# EAGLE design NSE2024 (EAGLE 9.6.2)
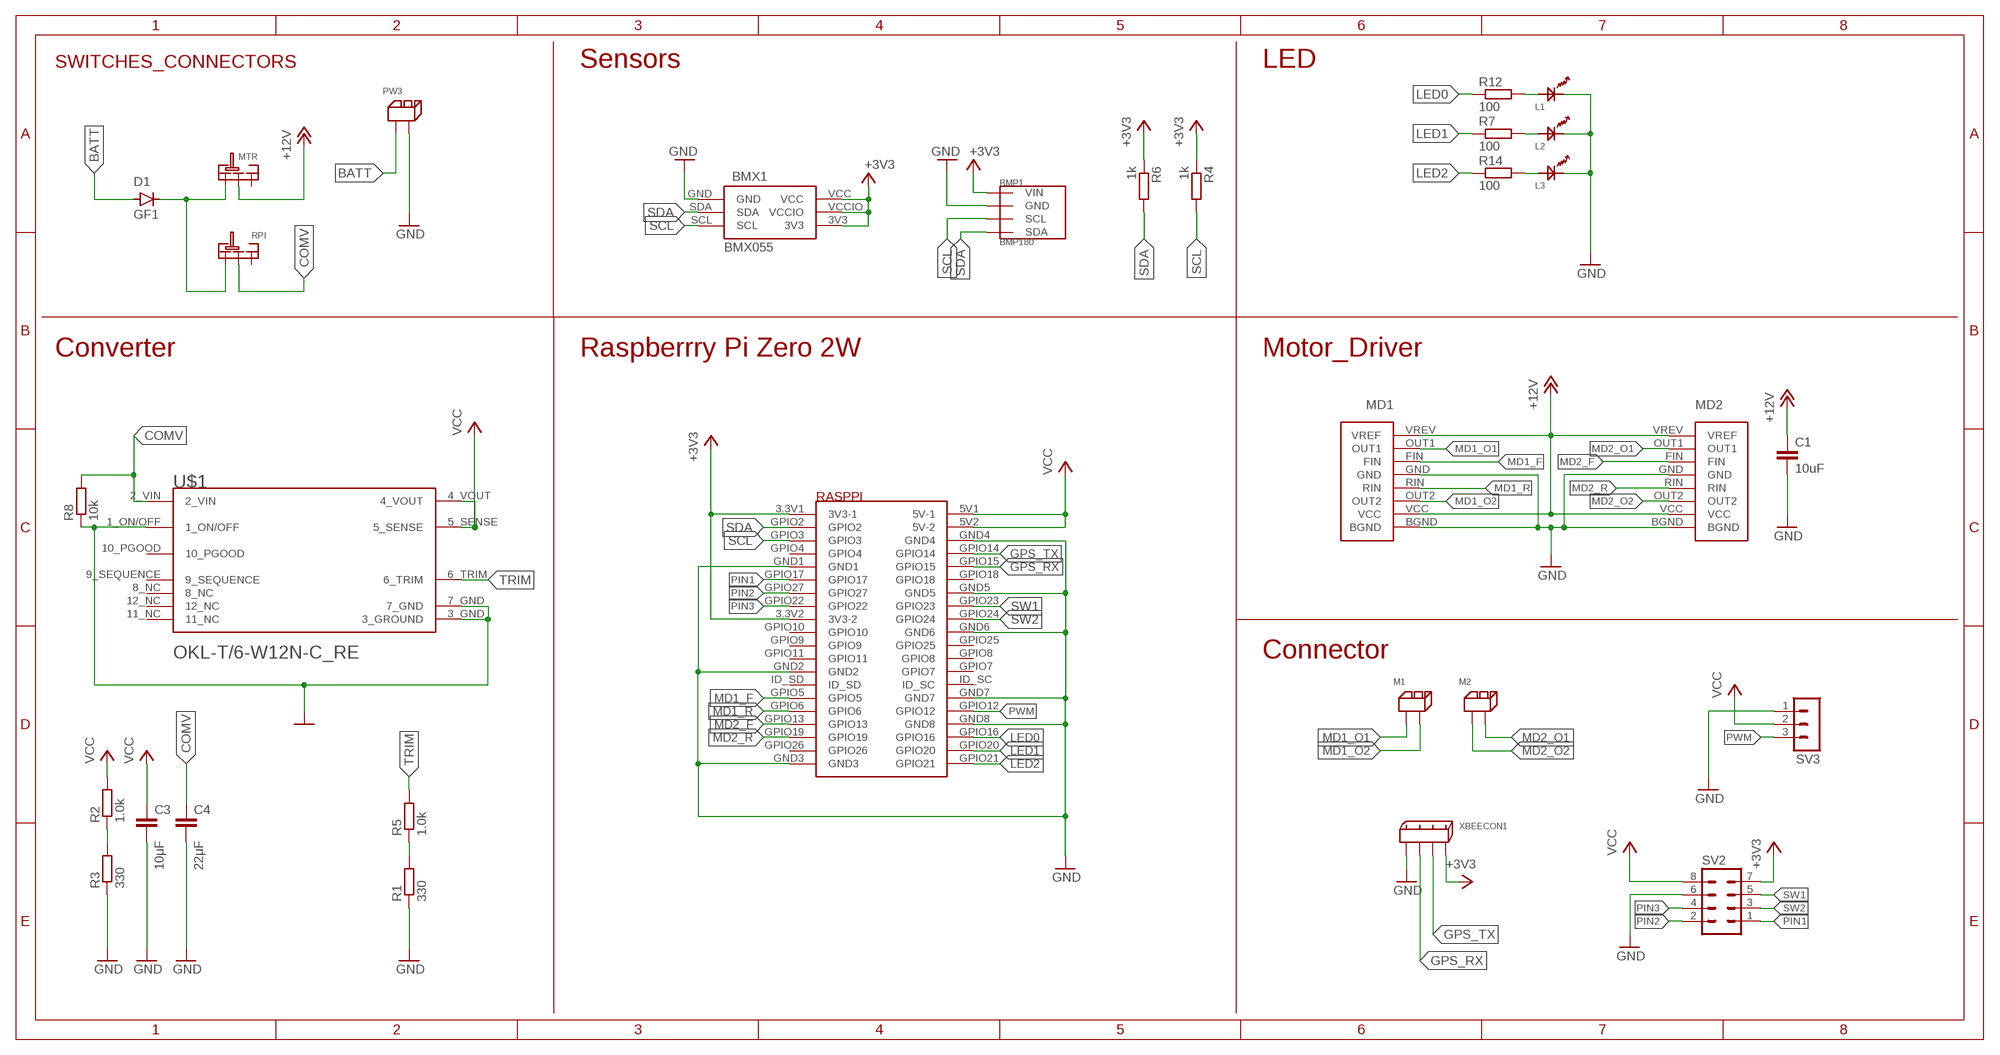
[diagram p0: schematic, sheet 1]

## Parts
BMP1  BMP180  [GY-68]
BMX1  BMX055  [BMX055]
C1  10uF  C-EUC0603  [C0603]
C3  10μF  C-EUC0603  [C0603]
C4  22μF  C-EUC0805  [C0805]
D1  GF1  [SMA-DO214AC]
L1  OSXX1608C1A  [OSXX1608C1A]
L2  OSXX1608C1A  [OSXX1608C1A]
L3  OSXX1608C1A  [OSXX1608C1A]
M1  2PIN  [2PIN]
M2  2PIN  [2PIN]
MD1  BD6222HFP-TR  [BD6222HFP-TR]
MD2  BD6222HFP-TR  [BD6222HFP-TR]
MTR  SRIDE_SWITCH  [SRIDE_SWITCH]
PW3  2PIN  [2PIN]
R1  330  R-EU_R0603  [R0603]
R2  1.0k  R-EU_R0603  [R0603]
R3  330  R-EU_R0603  [R0603]
R4  1k  R-EU_R0603  [R0603]
R5  1.0k  R-EU_R0603  [R0603]
R6  1k  R-EU_R0603  [R0603]
R7  100  R-EU_R0603  [R0603]
R8  10k  R-EU_R0603  [R0603]
R12  100  R-EU_R0603  [R0603]
R14  100  R-EU_R0603  [R0603]
RASPPI  RASPBERYPIZEROW  [RASPBERYPIZEROW]
RPI  SRIDE_SWITCH  [SRIDE_SWITCH]
SV2  MA04-2  [MA04-2]
SV3  MA03-1  [MA03-1]
U$1  OKL-T/6-W12N-C_RE  [MURATA_IKL-T-6-W12N-C_0_RECOMENDED]
XBEECON1  2.5_MINI-SPOX_4PIN  [2.5_MINI-SPOX_4PIN]

## Nets
+3V3: BMP1.P1(VIN) BMX1.3V3 BMX1.VCC BMX1.VCCIO R4.1 R6.1 RASPPI.3.3V1(3V3-1) RASPPI.3.3V2(3V3-2) SV2.7 XBEECON1.P$4
+5V: C3.1 U$1.4_VOUT U$1.5_SENSE ; supply symbol labelled VCC
+12V: C1.1 MD1.VCC MD1.VREV(VREF) MD2.VCC MD2.VREV(VREF) MTR.LR
BATT: D1.A PW3.P$1
COMV: C4.1 R8.2 RPI.LR U$1.2_VIN
GND: BMP1.P2(GND) BMX1.GND C1.2 C3.2 C4.2 L1.CT L2.CT L3.CT MD1.BGND MD1.GND MD2.BGND MD2.GND PW3.P$2 R1.1 R3.1 R8.1 RASPPI.GND1 RASPPI.GND2 RASPPI.GND3 RASPPI.GND4 RASPPI.GND5 RASPPI.GND6 RASPPI.GND7 RASPPI.GND8 SV2.6 SV3.1 U$1.1_ON/OFF U$1.3_GND(3_GROUND) U$1.7_GND XBEECON1.P$1
GPS_RX: RASPPI.GPIO15 XBEECON1.P$2
GPS_TX: RASPPI.GPIO14 XBEECON1.P$3
LED0: R12.1 RASPPI.GPIO16
LED1: R7.1 RASPPI.GPIO20
LED2: R14.1 RASPPI.GPIO21
MD1_F: MD1.FIN RASPPI.GPIO5
MD1_O1: M1.P$1 MD1.OUT1
MD1_O2: M1.P$2 MD1.OUT2
MD1_R: MD1.RIN RASPPI.GPIO6
MD2_F: MD2.FIN RASPPI.GPIO13
MD2_O1: M2.P$2 MD2.OUT1
MD2_O2: M2.P$1 MD2.OUT2
MD2_R: MD2.RIN RASPPI.GPIO19
N$1: R1.2 R5.1
N$2: R2.1 R3.2
N$5: L1.AN R12.2
N$6: D1.K(C) MTR.L RPI.L
N$8: L3.AN R14.2
N$9: L2.AN R7.2
PIN1: RASPPI.GPIO17 SV2.1
PIN2: RASPPI.GPIO27 SV2.2
PIN3: RASPPI.GPIO22 SV2.4
PWM: RASPPI.GPIO12 SV3.3
SCL: BMP1.P3(SCL) BMX1.SCL R4.2 RASPPI.GPIO3
SDA: BMP1.P4(SDA) BMX1.SDA R6.2 RASPPI.GPIO2
SW1: RASPPI.GPIO23 SV2.5
SW2: RASPPI.GPIO24 SV2.3
TRIM: R5.2 U$1.6_TRIM
VCC: R2.2 RASPPI.5V1(5V-1) RASPPI.5V2(5V-2) SV2.8 SV3.2
Unconnected: MTR.R RASPPI.GPIO4 RASPPI.GPIO7 RASPPI.GPIO8 RASPPI.GPIO9 RASPPI.GPIO10 RASPPI.GPIO11 RASPPI.GPIO18 RASPPI.GPIO25 RASPPI.GPIO26 RASPPI.ID_SC RASPPI.ID_SD RPI.R U$1.8_NC U$1.9_SEQUENCE U$1.10_PGOOD U$1.11_NC U$1.12_NC

## Notes on the sheet
- SWITCHES_CONNECTORS | Sensors | LED
- Converter | Raspberrry Pi Zero 2W | Motor_Driver
- Connector

## Library data of the parts
BMP1 = BMP180:BMP180
BMX1 = BMX055:BMX055
C1 C3 C4 = rcl:C-EU: CAPACITOR, European symbol; SPICEPREFIX: C
D1 = diode:GF1: DIODE
L1-L3 = Chip LED:OSXX1608C1A
M1 M2 PW3 = XR Connector:2PIN
MD1 MD2 = BD6222HFP-TR:BD6222HFP-TR
MTR RPI = Sride Switch:SRIDE_SWITCH
R1-R8 R12 R14 = rcl:R-EU_: RESISTOR, European symbol; SPICEPREFIX: R
RASPPI = RaspberyPiZeroW:RASPBERYPIZEROW
SV2 = con-lstb:MA04-2: PIN HEADER; OC_FARNELL: unknown; OC_NEWARK: unknown
SV3 = con-lstb:MA03-1: PIN HEADER; OC_FARNELL: unknown; OC_NEWARK: unknown
U$1 = OKL-T_6-W12N-C:OKL-T/6-W12N-C_RE
XBEECON1 = Connector:2.5_MINI-SPOX_4PIN

## Board
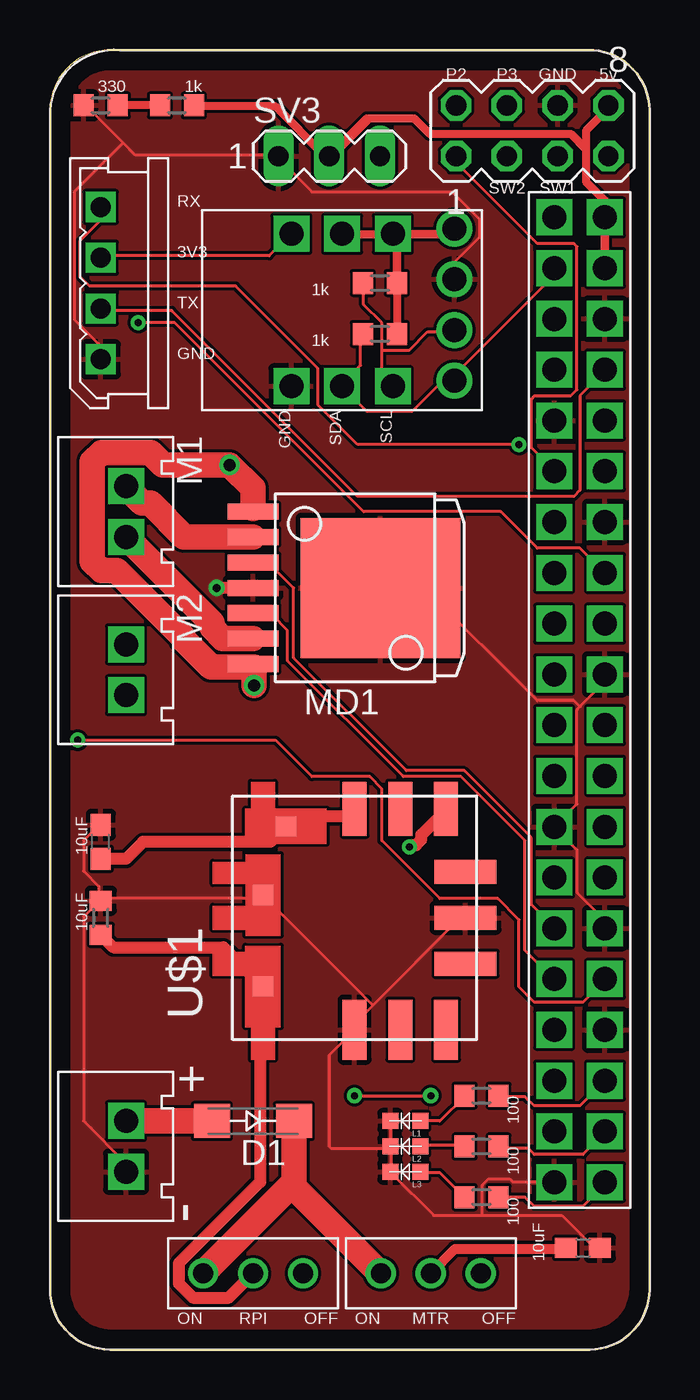
[diagram p1: board, top side]
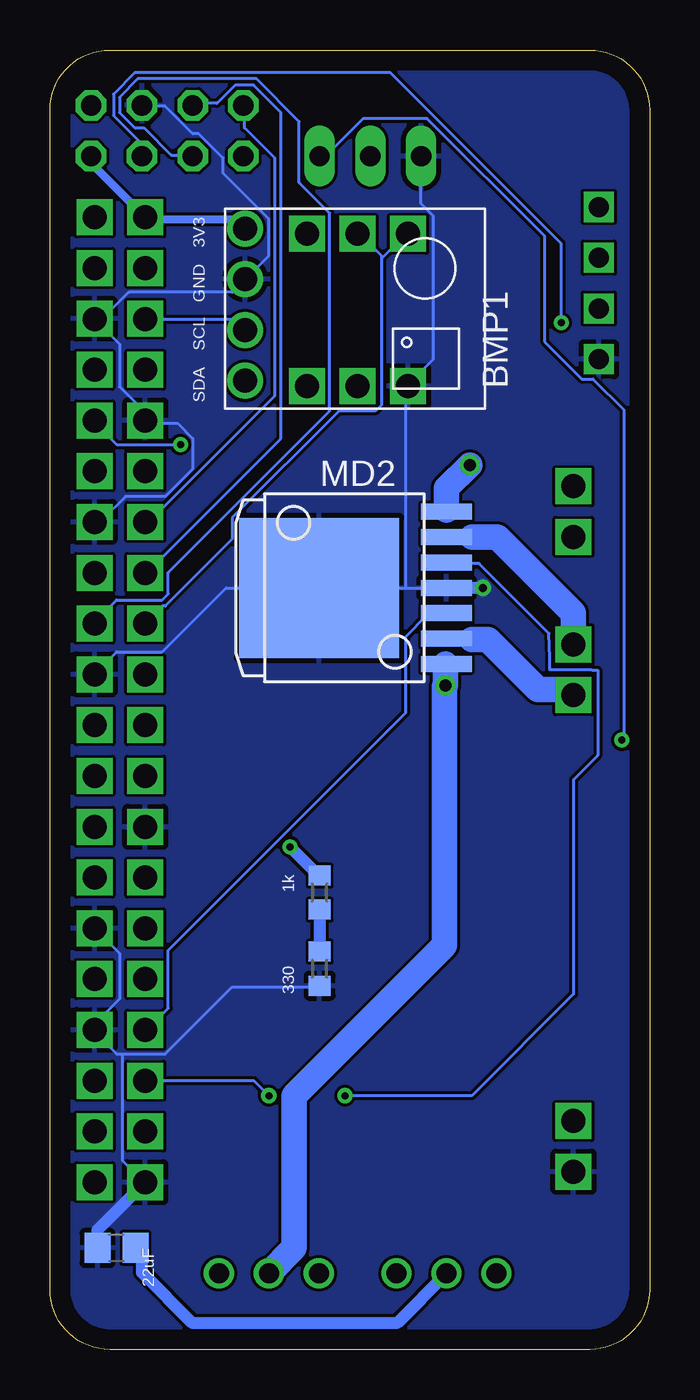
[diagram p2: board, bottom side, seen from below]

Size 30 x 65 mm. Coordinates in mm from the lower left corner, seen from the top.
Outline: 3,0 27,0 arc90 30,3 30,62 arc90 27,65 3,65 arc90 0,62 0,3 arc90 3,0
Copper layers (1*16): Top 0.035mm / dielectric 1.5mm / Bottom 0.035mm
Design rules "default": minimum track width 6mil, minimum drill 0.35mm, track to track 6mil, track to pad 6mil, pad to pad 6mil, via to via 6mil, smd to smd 6mil, copper to edge 40mil, drill to drill 6mil, minimum pad ring 10mil, minimum via ring 8mil, stop-mask expansion 4mil, vias tented up to drill 0mil, thermal gap 10mil

### Footprints (pad centres in the part's own frame; a part is rotated, then mirrored left to right if it is on the bottom)
GY-68 = drill 1.2: P1 -5,4; P2 -5,1.46; P3 -5,-1.08; P4 -5,-3.62
BMX055 = drill 1.2 pad 1.5 square: 3V3 8.81,-9.53; GND 1.19,-4.46; SCL 1.19,-9.53; SDA 1.19,-7; VCC 8.81,-4.46; VCCIO 8.81,-7
C0603 = smd 1.1 x 1: 1 -0.85,0; 2 0.85,0
C0805 = smd 1.3 x 1.5: 1 -0.95,0; 2 0.95,0
SMA-DO214AC = smd 1.8 x 1.7: A -2.05,0; K 2.05,0
OSXX1608C1A = smd 0.8 x 0.8: AN -0.75,0; CT 0.75,0
2PIN = drill 1.2 square: P$1 -1.27,0; P$2 1.27,0
BD6222HFP-TR = smd 7 x 8: BGND 0,6.378 | smd 0.8 x 2.54: FIN -1.27,0; GND 0,0; OUT1 -2.54,0; OUT2 2.54,0; RIN 1.27,0; VCC 3.81,0; VREV -3.81,0
SRIDE_SWITCH = drill 1: L -2.5,0; LR 0,0; R 2.5,0
R0603 = smd 1 x 1.1: 1 -0.85,0; 2 0.85,0
RASPBERYPIZEROW = drill 1.2 pad 1.676 square: 3.3V1 -1.27,24.13; 3.3V2 -1.27,3.81; 5V1 1.27,24.13; 5V2 1.27,21.59; GND1 -1.27,13.97; GND2 -1.27,-6.35; GND3 -1.27,-24.13; GND4 1.27,19.05; GND5 1.27,8.89; GND6 1.27,1.27; GND7 1.27,-11.43; GND8 1.27,-16.51; GPIO2 -1.27,21.59; GPIO3 -1.27,19.05; GPIO4 -1.27,16.51; GPIO5 -1.27,-11.43; GPIO6 -1.27,-13.97; GPIO7 1.27,-6.35; GPIO8 1.27,-3.81; GPIO9 -1.27,-1.27; GPIO10 -1.27,1.27; GPIO11 -1.27,-3.81; GPIO12 1.27,-13.97; GPIO13 -1.27,-16.51; GPIO14 1.27,16.51; GPIO15 1.27,13.97; GPIO16 1.27,-19.05; GPIO17 -1.27,11.43; GPIO18 1.27,11.43; GPIO19 -1.27,-19.05; GPIO20 1.27,-21.59; GPIO21 1.27,-24.13; GPIO22 -1.27,6.35; GPIO23 1.27,6.35; GPIO24 1.27,3.81; GPIO25 1.27,-1.27; GPIO26 -1.27,-21.59; GPIO27 -1.27,8.89; ID_SC 1.27,-8.89; ID_SD -1.27,-8.89
MA04-2 = drill 1.016 octagon: 1 -3.81,-1.27; 2 -3.81,1.27; 3 -1.27,-1.27; 4 -1.27,1.27; 5 1.27,-1.27; 6 1.27,1.27; 7 3.81,-1.27; 8 3.81,1.27
MA03-1 = drill 1.016 long: 1 -2.54,0; 2 0,0; 3 2.54,0
MURATA_IKL-T-6-W12N-C_0_RECOMENDED = smd 3 x 1.2: 1_ON/OFF -5.6,0; 9_SEQUENCE -5.6,-4.58; 10_PGOOD -5.6,-2.29 | smd 1 x 1: 2_VIN -3.435,4.58; 3_GND 1.145,4.58; 4_VOUT 4.585,3.435 | smd 2.7 x 1.2: 5_SENSE 5.45,0; 6_TRIM 5.45,-4.58; 11_NC 5.45,-2.29 | smd 1.2 x 3.1: 7_GND 0,-5.55; 8_NC -2.29,-5.55; 12_NC 2.29,-5.55
2.5_MINI-SPOX_4PIN = drill 1 square: P$1 -1.27,0; P$2 6.35,0; P$3 1.27,0; P$4 3.81,0

### Placement (x,y rotation side)
BMP1  15.24,52.07 0 bottom
BMX1  7.62,46.99 90 top
C1  26.67,5.08 0 top
C3  2.54,25.4 90 top
C4  26.67,5.08 180 bottom
D1  10.16,11.43 0 top
L1  17.78,11.43 180 top
L2  17.78,10.16 180 top
L3  17.78,8.89 180 top
M1  3.81,41.91 270 top
M2  3.81,34 270 top
MD1  10.16,38.1 270 top
MD2  10.16,38.1 90 bottom
MTR  19.05,3.81 0 top
PW3  3.81,10.16 270 top
R1  16.51,19.05 90 bottom
R2  6.35,62.23 0 top
R3  2.54,62.23 0 top
R4  16.51,53.34 180 top
R5  16.51,22.86 90 bottom
R6  16.51,50.8 180 top
R7  21.59,10.16 180 top
R8  2.54,21.59 270 top
R12  21.59,12.7 180 top
R14  21.59,7.62 180 top
RASPPI  26.5,32.5 0 top
RPI  10.16,3.81 0 top
SV2  24.13,60.96 0 top
SV3  13.97,59.69 0 top
U$1  15.24,21.59 90 top
XBEECON1  2.54,50.8 90 top

### Tracks (layer width: path | path; a pad name or v marks a point on that pad's centre or on a via)
+3V3
  Top 0.152: R6.1 17.37,50.85 17.37,50.9 17.37,53.34 R4.1 17.22,53.34 17.22,55.78 BMX1.3V3 | BMP1.P1 20.18,56 20.12,55.93 17.22,55.93 BMX1.3V3 | XBEECON1.P$4 2.59,54.71 10.97,54.71 12.04,55.78 BMX1.VCC | BMX1.3V3 17.07,55.78 14.63,55.78 BMX1.VCCIO
  Top 0.406: BMX1.VCCIO 19.98,55.8 20.18,56 | BMX1.3V3 17.37,55.58 17.37,53.34 | R4.1 17.37,50.85
  Bottom 0.152: SV2.7 27.89,59.59 27.89,59.28 25.3,56.69 RASPPI.3.3V1 25.15,56.54 20.73,56.54 | 13.41,54.56 13.41,54.71 14.48,55.78 BMX1.VCCIO | 13.41,54.56 13.41,47.24 13.72,46.94 15.54,46.94 20.88,41.6 20.88,40.54 24.23,37.19 24.38,37.19 25.15,36.42 RASPPI.3.3V2 | 13.41,54.56 12.19,55.78 BMX1.VCC
  Bottom 0.406: SV2.7 27.94,59.33 25.15,56.54 | RASPPI.3.3V1 25.14,56.54 20.73,56.54 20.71,56.54 BMP1.P1
+5V
  Top 0.152: 11.89,26.21 U$1.4_VOUT
  Top 0.61: U$1.5_SENSE 14.87,26.67 11.43,26.67 11.89,26.21 | U$1.4_VOUT 11.03,25.4 4.66,25.4 3.81,24.55 C3.1
+12V  (via drill 0.6)
  Top 0.152: 25.76,5.03 C1.1 | 10.21,34.14 10.21,34.29 MD1.VCC
  Top 0.508: MTR.LR 20.27,5.03 25.76,5.03
  Top 0.61: MD2.VCC 10.16,42.06
  Top 1.27: 10.16,42.06 10.16,43.08 v8.99,44.25 5.66,44.25 5.04,44.87 2.58,44.87 2.12,44.41 2.12,39.41 2.58,38.95 3.33,38.95 6.68,35.6 6.68,35.52 8.06,34.14 10.21,34.14 v10.21,33.22
  Bottom 0.152: 10.21,34.29 MD1.VCC
  Bottom 0.61: MD2.VCC 10.16,41.98
  Bottom 1.27: 10.21,34.29 v10.21,33.22 10.26,33.17 10.26,20.22 17.78,12.7 17.78,5.08 MTR.LR | v8.99,44.25 10.16,43.08 10.16,41.98
BATT
  Top 0.152: 7.62,11.43 D1.A
  Top 1.27: PW3.P$1 7.62,11.43
COMV
  Top 0.152: 9.96,18.85 10.52,18.29 U$1.2_VIN 10.52,18.14 10.52,15.24
  Top 0.61: 10.52,15.24 10.52,8.38 6.45,4.31 6.45,3.31 7.16,2.6 8.95,2.6 RPI.LR | R8.2 3.16,20.12 8.69,20.12 9.96,18.85
  Bottom 0.152: 25.4,5.03 25.6,5.03 C4.1
  Bottom 0.61: RPI.LR 12.65,1.32 22.86,1.32 25.4,3.86 25.4,5.03
GND  (via drill 0.4)
  Top 0.152: 3.66,60.35 4.27,59.74 11.43,59.74 SV3.1 11.43,59.59 13.11,57.91 20.12,57.91 21.49,56.54 21.49,55.63 20.27,54.41 20.27,53.65 BMP1.P2 | 3.66,60.35 1.83,62.18 R3.1 | 3.66,60.35 1.22,57.91 1.22,51.51 2.44,50.29 2.44,49.53 XBEECON1.P$1 | RASPPI.GND7 27.74,21.18 27.74,21.49 26.36,22.86 26.36,24.99 25.3,26.06 RASPPI.GND2 25.3,26.21 26.36,27.28 26.36,32 26.52,32.16 | 26.52,32.16 27.74,33.38 27.74,33.68 RASPPI.GND6 | MD1.BGND 18.75,38.1 24.38,32.46 26.21,32.46 26.52,32.16 | R8.1 2.44,22.55 2.44,23.16 1.68,23.93 1.68,25.45 2.44,26.21 C3.2 | R8.1 2.59,22.55 10.36,22.55 10.52,22.71 U$1.3_GND 10.67,22.71 16.15,17.22 | PW3.P$2 3.81,9.3 1.68,11.43 1.68,21.64 2.44,22.4 R8.1 | 17.07,10.06 17.07,8.99 L3.CT 17.07,8.84 19.2,6.71 21.64,6.71 | 17.07,10.06 L2.CT 17.07,10.21 17.07,11.43 L1.CT | 21.64,6.71 25.6,6.71 27.13,5.18 27.43,5.18 C1.2 | 16.15,17.22 15.24,16.31 U$1.1_ON/OFF 13.97,14.72 13.97,10.16 14.07,10.06 17.07,10.06 | 16.15,17.22 20.42,21.49 20.73,21.49 U$1.7_GND | 21.64,6.71 21.64,8.23 21.95,8.53 23.01,8.53 23.16,8.38 25.15,8.38 RASPPI.GND3
  Top 0.61: MD1.GND v8.34,38.1
  Bottom 0.152: 27.58,51.36 27.74,51.51 RASPPI.GND4 27.58,51.36 | 27.58,51.36 26.52,50.29 26.52,48.16 25.3,46.94 25.3,46.48 RASPPI.GND1 25.15,46.33 23.62,46.33 22.86,45.57 22.86,44.04 24.23,42.67 26.21,42.67 27.43,41.45 27.74,41.45 RASPPI.GND5 | SV2.6 25.3,62.18 24.23,62.18 22.86,60.81 22.55,60.81 21.34,59.59 21.34,58.83 19.05,56.54 19.05,54.71 20.12,53.65 BMP1.P2 20.27,53.49 20.88,52.88 26.06,52.88 27.58,51.36 | 12.19,38.1 MD1.BGND 21.18,38.1 24.38,34.9 26.67,34.9 27.74,33.83 RASPPI.GND6 | 12.19,38.1 MD1.GND | 12.19,38.1 12.19,48.16 BMX1.GND 12.04,48.31 10.82,49.53 10.82,56.69 11.43,57.3 SV3.1 | 26.36,14.78 26.67,14.78 27.74,15.85 RASPPI.GND8 27.74,16 27.74,16.31 26.52,17.53 26.52,19.81 27.74,21.03 RASPPI.GND7 | 26.36,14.78 24.23,14.78 20.88,18.14 16.61,18.14 R1.1 | 26.36,14.78 26.36,9.45 25.3,8.38 RASPPI.GND3
  Bottom 0.61: C4.2 27.62,5.98 RASPPI.GND3 | v8.34,38.1 MD1.GND
  pour Top: -2.54,-1.27 31.75,-1.27 31.75,67.31 -2.54,67.31
  pour Bottom: -2.54,67.31 -2.54,-1.27 30.48,-1.27 31.75,-1.27 31.75,67.31
GPS_RX  (via drill 0.35)
  Top 0.152: v23.47,45.26 15.39,45.26 13.41,47.24 13.41,49.07 9.3,53.19 1.98,53.19 1.52,53.65 1.52,55.47 2.44,56.39 2.44,57.15 XBEECON1.P$2
  Bottom 0.152: v23.47,45.26 26.67,45.26 27.74,46.33 RASPPI.GPIO15
GPS_TX
  Top 0.152: XBEECON1.P$3 2.59,51.97 6.1,51.97 15.39,42.67 26.21,42.67 26.52,42.98 26.52,47.7 27.74,48.92 RASPPI.GPIO14
LED0
  Top 0.152: R12.1 22.55,12.65 23.77,12.65 24.23,12.19 26.52,12.19 27.74,13.41 RASPPI.GPIO16
LED1
  Top 0.152: R7.1 22.55,10.06 23.93,10.06 24.23,9.75 26.67,9.75 27.74,10.82 RASPPI.GPIO20
LED2
  Top 0.152: R14.1 23.77,7.62 24.23,7.16 26.67,7.16 27.74,8.23 RASPPI.GPIO21
MD1_F
  Top 0.152: MD1.FIN 10.21,39.32 10.97,39.32 12.19,38.1 12.19,34.59 17.83,28.96 20.73,28.96 24.08,25.6 24.08,22.25 25.15,21.18 RASPPI.GPIO5
MD1_O1
  Top 0.152: 3.81,43.13 M1.P$1
  Top 1.27: 3.81,43.13 4.61,42.33 5.04,42.33 6.72,40.64 MD1.OUT1
MD1_O2
  Top 1.27: M1.P$2 8.1,36.35 8.1,36.1 8.65,35.56 MD1.OUT2
MD1_R
  Top 0.152: MD1.RIN 10.21,36.73 11.12,36.73 11.89,35.97 11.89,34.44 17.68,28.65 20.57,28.65 23.77,25.45 23.77,19.96 25.15,18.59 RASPPI.GPIO6
MD2_F
  Bottom 0.152: MD2.FIN 10.21,36.73 11.12,36.73 12.19,35.66 12.19,31.85 24.08,19.96 24.08,17.07 25.15,16 RASPPI.GPIO13
MD2_O1
  Bottom 0.152: 8.89,35.51 10.06,35.51 MD2.OUT1
  Bottom 1.27: M2.P$2 4.1,33.02 5.59,33.02 8.07,35.51 8.89,35.51
MD2_O2
  Bottom 0.203: MD2.OUT2 8.89,40.64
  Bottom 1.27: 8.89,40.64 8.63,40.64 7.62,40.64 3.81,36.83 M2.P$1
MD2_R  (via drill 0.35)
  Top 0.152: v15.24,12.7 v19.05,12.7
  Bottom 0.152: MD2.RIN 10.06,39.32 8.53,39.32 5.03,35.81 5,34.59 5,34 2.9,34 2.59,33.98 2.59,29.72 3.81,28.5 3.81,17.78 8.89,12.7 v15.24,12.7 | v19.05,12.7 19.8,13.45 RASPPI.GPIO19
N$1
  Bottom 0.152: 16.46,19.96 R1.2
  Bottom 0.61: R5.1 16.51,20.02 16.46,19.96
N$2
  Top 0.406: R2.1 R3.2
N$5
  Top 0.152: L1.AN 19.51,11.43 20.73,12.65 R12.2
N$6
  Top 0.152: 12.34,7.92 12.34,11.43 D1.K | 12.34,7.92 16.46,3.81 16.51,3.81 MTR.L | RPI.L 8.23,3.81 12.34,7.92
  Top 1.27: D1.K 12.21,8.36 | 12.21,8.36 RPI.L | 12.21,8.36 12.21,8.11 16.51,3.81
N$8
  Top 0.152: L3.AN 18.59,8.84 19.51,8.84 20.73,7.62 R14.2
N$9
  Top 0.152: L2.AN 18.59,10.21 20.73,10.21 R7.2
PIN1
  Top 0.152: SV2.1 20.42,59.59 20.42,59.28 24.38,55.32 26.21,55.32 26.36,55.17 26.36,48.01 26.06,47.7 24.23,47.7 24.08,47.55 24.08,45.11 25.15,44.04 RASPPI.GPIO17
PIN2
  Bottom 0.152: SV2.2 20.27,62.18 20.27,61.11 18.75,59.59 18.75,47.7 25.15,41.3 RASPPI.GPIO27
PIN3
  Bottom 0.152: SV2.4 22.86,62.33 21.64,62.33 20.73,63.25 19.81,63.25 18.44,61.87 18.44,45.57 25.15,38.86 RASPPI.GPIO22
PWM  (via drill 0.35)
  Top 0.152: RASPPI.GPIO12 27.74,18.44 26.67,17.37 24.23,17.37 23.47,18.14 23.47,21.49 22.4,22.55 19.51,22.55 16.61,25.45 16.61,28.04 16,28.65 13.11,28.65 11.28,30.48 v1.39,30.48
  Bottom 0.152: SV3.3 16.46,59.74 16.15,59.74 14.33,61.57 11.12,61.57 5.26,55.7 5.26,50.42 3.39,48.55 2.83,48.55 1.27,46.99 1.27,30.48 v1.39,30.48
SCL
  Top 0.152: 16.61,49.99 16.61,48.77 17.07,48.31 BMX1.SCL | 16.61,49.99 16.61,51.36 15.7,52.27 15.7,53.34 R4.2 | 16.61,49.99 17.98,49.99 18.9,50.9 20.12,50.9 BMP1.P3
  Bottom 0.152: RASPPI.GPIO3 25.15,51.51 20.73,51.51 20.27,51.05 BMP1.P3
SDA
  Top 0.152: R6.2 15.54,50.75 15.54,49.23 14.63,48.31 BMX1.SDA 14.63,48.16 15.85,46.94 18.14,46.94 19.51,48.31 20.12,48.31 BMP1.P4 20.27,48.46 20.27,48.77 25.15,53.65 25.15,53.95 RASPPI.GPIO2
SW1  (via drill 0.35)
  Top 0.152: v4.42,51.36 6.25,51.36 15.7,41.91 22.55,41.91 24.38,40.08 26.52,40.08 27.74,38.86 RASPPI.GPIO23
  Bottom 0.152: v4.42,51.36 4.42,55.32 12.95,63.86 25.76,63.86 26.82,62.79 26.82,61.72 25.45,60.35 25.45,59.74 SV2.5
SW2
  Bottom 0.152: SV2.3 22.86,59.74 23.93,59.74 25.3,61.11 25.76,61.11 26.52,61.87 26.52,62.64 25.6,63.55 19.66,63.55 17.53,61.42 17.53,58.37 16,56.84 16,46.94 24.08,38.86 24.08,37.8 24.38,37.49 26.67,37.49 27.74,36.42 RASPPI.GPIO24
TRIM  (via drill 0.35)
  Top 0.152: 19.81,26.98 U$1.6_TRIM
  Top 0.61: v17.98,25.15 18.07,25.23 18.32,25.23 18.59,25.5 18.59,25.75 19.81,26.98
  Bottom 0.152: 16.61,23.77 R5.2
  Bottom 0.61: v17.98,25.15 16.61,23.77
VCC
  Top 0.152: 7.62,62.18 7.32,62.18 R2.2 | RASPPI.5V2 27.89,54.1 27.89,56.54 RASPPI.5V1 | 16.15,61.57 14.33,59.74 14.02,59.74 SV3.2 | 19,60.81 19.05,60.81
  Top 0.406: RASPPI.5V2 RASPPI.5V1 27.77,57.47 26.82,58.42 26.82,60.05 | SV2.8 27.94,62.08 26.82,60.96 26.82,60.05 | 19,60.81 18.24,61.57 16.15,61.57 15.85,61.57 SV3.2 13.77,59.69 11.28,62.18 7.62,62.18 | 26.82,60.05 26.06,60.81 19.05,60.81

### Text on the board
tPlace: 330 | 1k | P2 | P3 | GND | 5v | SW2 | SW1 | RX | 3V3 | 1k | TX | 1k | GND | GND | SDA | SCL | 10uF | 10uF | + | 100 | 100 | 100 | - | 10uF | ON | OFF | ON | OFF
bPlace: 3V3 | GND | SCL | SDA | 1k | 330 | 22uF